# EAGLE design a-star-is31 (EAGLE 7.4.0)
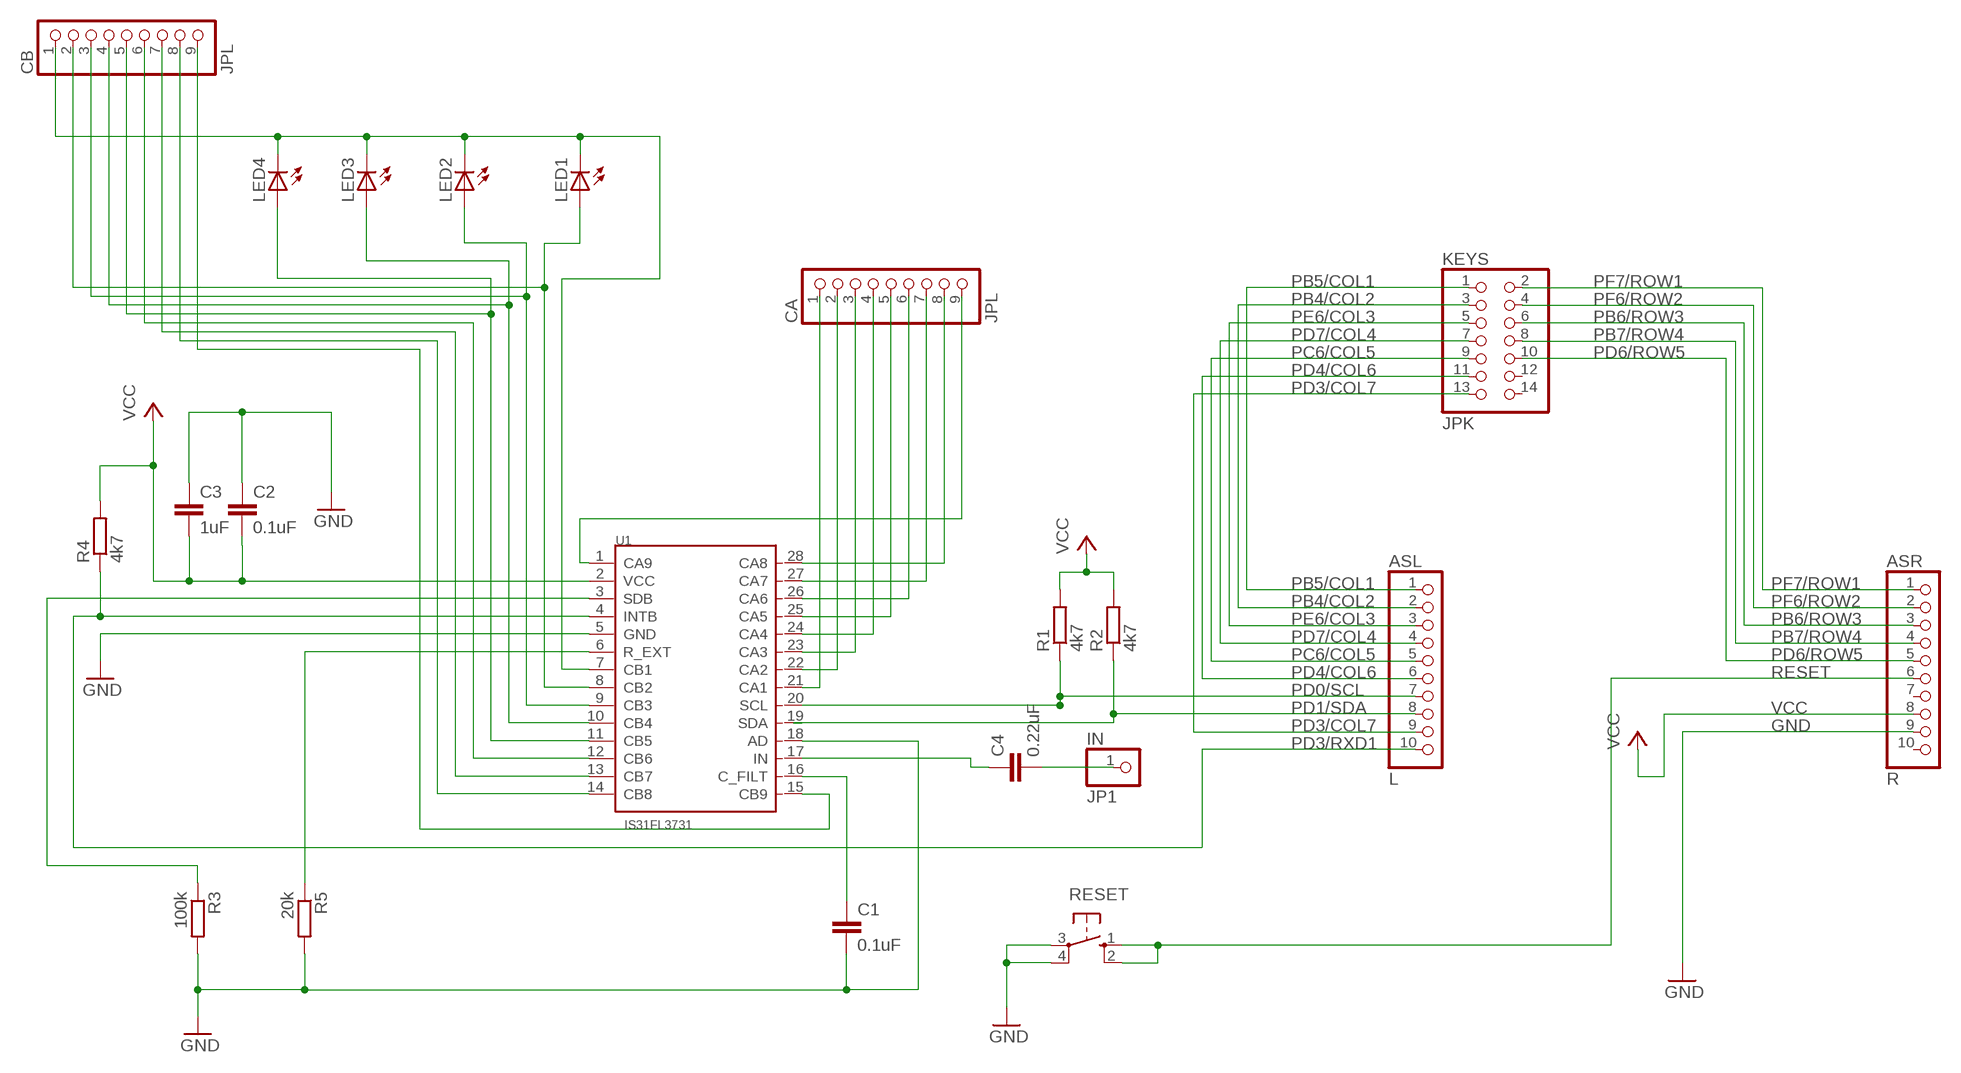
[diagram p0: schematic, sheet 1]

## Parts
ASL  L  PINHD-1X10  [1X10]
ASR  R  PINHD-1X10  [1X10]
C1  0.1uF  C-EU025-025X050  [C025-025X050]
C2  0.1uF  C-EU025-025X050  [C025-025X050]
C3  1uF  C-EU025-025X050  [C025-025X050]
C4  0.22uF  C-EU025-025X050  [C025-025X050]
CA  JPL  PINHD-1X9  [1X09]
CB  JPL  PINHD-1X9  [1X09]
IN  JP1  PINHD-1X1  [1X01]
KEYS  JPK  PINHD-2X7  [2X07]
LED1  LED3MM  [LED3MM]
LED2  LED3MM  [LED3MM]
LED3  LED3MM  [LED3MM]
LED4  LED3MM  [LED3MM]
R1  4k7  R-EU_0207/10  [0207/10]
R2  4k7  R-EU_0207/10  [0207/10]
R3  100k  R-EU_0207/10  [0207/10]
R4  4k7  R-EU_0207/10  [0207/10]
R5  20k  R-EU_0207/10  [0207/10]
RESET  10-XX  [B3F-10XX]
U1  IS31FL3731  IS31FL3731(SSOP28)  [SSOP28-0.65-10.2X5.2MM]

## Nets
CA8 [led]: CA.8 U1.28(CA8)
CB9 [led]: CB.9 U1.15(CB9)
GND: ASR.9 C1.2 C2.1 C3.1 R3.2 R5.2 RESET.3(P) RESET.4(P1) U1.5(GND) U1.18(AD)
N$1: C4.1 U1.17(IN)
N$2: C4.2 IN.1
N$5: R5.1 U1.6(R_EXT)
N$6 [led]: CA.1 U1.21(CA1)
N$7: C1.1 U1.16(C_FILT)
N$8 [led]: CA.2 U1.22(CA2)
N$9 [led]: CA.3 U1.23(CA3)
N$10 [led]: CA.4 U1.24(CA4)
N$11 [led]: CA.5 U1.25(CA5)
N$12 [led]: CA.6 U1.26(CA6)
N$13 [led]: CA.7 U1.27(CA7)
N$14 [led]: CA.9 U1.1(CA9)
N$15 [led]: CB.1 LED1.K(C) LED2.K(C) LED3.K(C) LED4.K(C) U1.7(CB1)
N$16 [led]: CB.2 LED1.A U1.8(CB2)
N$17 [led]: CB.3 LED2.A U1.9(CB3)
N$18 [led]: CB.4 LED3.A U1.10(CB4)
N$19 [led]: CB.5 LED4.A U1.11(CB5)
N$20 [led]: CB.6 U1.12(CB6)
N$22 [led]: CB.7 U1.13(CB7)
N$23 [led]: CB.8 U1.14(CB8)
PB4/COL2: ASL.2 KEYS.3
PB5/COL1: ASL.1 KEYS.1
PB6/ROW3: ASR.3 KEYS.6
PB7/ROW4: ASR.4 KEYS.8
PC6/COL5: ASL.5 KEYS.9
PD0/SCL: ASL.7 R1.1 U1.20(SCL)
PD1/SDA: ASL.8 R2.1 U1.19(SDA)
PD2/RXD1: R3.1 U1.3(SDB)
PD3/COL7: ASL.9 KEYS.13
PD3/RXD1: ASL.10 R4.1 U1.4(INTB)
PD4/COL6: ASL.6 KEYS.11
PD6/ROW5: ASR.5 KEYS.10
PD7/COL4: ASL.4 KEYS.7
PE6/COL3: ASL.3 KEYS.5
PF6/ROW2: ASR.2 KEYS.4
PF7/ROW1: ASR.1 KEYS.2
RESET: ASR.6 RESET.1(S) RESET.2(S1)
VCC [power]: ASR.8 C2.2 C3.2 R1.2 R2.2 R4.2 U1.2(VCC)
Unconnected: ASR.7 ASR.10 KEYS.12 KEYS.14

## Library data of the parts
ASL ASR = pinhead:PINHD-1X10: PIN HEADER
C1-C4 = rcl:C-EU: CAPACITOR, European symbol
CA CB = pinhead:PINHD-1X9: PIN HEADER
IN = pinhead:PINHD-1X1: PIN HEADER
KEYS = pinhead:PINHD-2X7: PIN HEADER
LED1-LED4 = led:LED: LED OSRAM: - CHIPLED LG R971, LG N971, LY N971, LG Q971, LY Q971, LO R971, LY R971 LH N974, LH R974 LS Q976, LO Q976, LY Q976 LO Q996 - Hyper CHIPLED LW Q18S LB Q993, LB Q99A, LB R99A - SideLED LS A670, LO A670, LY A670, LG A670, LP A670 LB A673, LV A673, LT A673, LW A673 LH A674 LY A675 LS A676, LA A676, LO A676, LY A676, LW A676 LS A679, LY A679, LG A679 - Hyper Micro SIDELED® LS Y876, LA Y876, LO Y876, LY Y876 LT Y87S - SmartLED LW L88C, LW L88S LB L89C, LB L89S, LG L890 LS L89K, LO L89K, LY L89K LS L896, LA L896, LO L896, LY L896 - TOPLED LS T670, LO T670, LY T670, LG T670, LP T670 LSG T670, LSP T670, LSY T670, LOP T670, LYG T670 LG T671, LOG T671, LSG T671 LB T673, LV T673, LT T673, LW T673 LH T674 LS T676, LA T676, LO T676, LY T676, LB T676, LH T676, LSB T676, LW T676 LB T67C, LV T67C, LT T67C, LS T67K, LO T67K, LY T67K, LW E67C LS E67B, LA E67B, LO E67B, LY E67B, LB E67C, LV E67C, LT E67C LW T67C LS T679, LY T679, LG T679 LS T770, LO T770, LY T770, LG T770, LP T770 LB T773, LV T773, LT T773, LW T773 LH T774 LS E675, LA E675, LY E675, LS T675 LS T776, LA T776, LO T776, LY T776, LB T776 LHGB T686 LT T68C, LB T68C - Hyper Mini TOPLED® LB M676 - Mini TOPLED Santana® LG M470 LS M47K, LO M47K, LY M47K Source: http://www.osram.convergy.de LUXEON: - LUMILED® LXK2-PW12-R00, LXK2-PW12-S00, LXK2-PW14-U00, LXK2-PW14-V00 LXK2-PM12-R00, LXK2-PM12-S00, LXK2-PM14-U00 LXK2-PE12-Q00, LXK2-PE12-R00, LXK2-PE12-S00, LXK2-PE14-T00, LXK2-PE14-U00 LXK2-PB12-K00, LXK2-PB12-L00, LXK2-PB12-M00, LXK2-PB14-N00, LXK2-PB14-P00, LXK2-PB14-Q00 LXK2-PR12-L00, LXK2-PR12-M00, LXK2-PR14-Q00, LXK2-PR14-R00 LXK2-PD12-Q00, LXK2-PD12-R00, LXK2-PD12-S00 LXK2-PH12-R00, LXK2-PH12-S00 LXK2-PL12-P00, LXK2-PL12-Q00, LXK2-PL12-R00 Source: www.luxeon.com KINGBRIGHT: KA-3528ASYC Source: www.kingbright.com
R1-R5 = rcl:R-EU_: RESISTOR, European symbol
RESET = switch-omron:10-XX: OMRON SWITCH; MPN: B3F-1000; OC_FARNELL: 176432; OC_NEWARK: 36M3542
U1 = kiibohd:IS31FL3731(SSOP28): 310080003; MPN: WM8731SEDS/V

## Net classes
0 default: width 0.305 mm
1 power: width 0.406 mm
2 led: width 0.406 mm

## Board
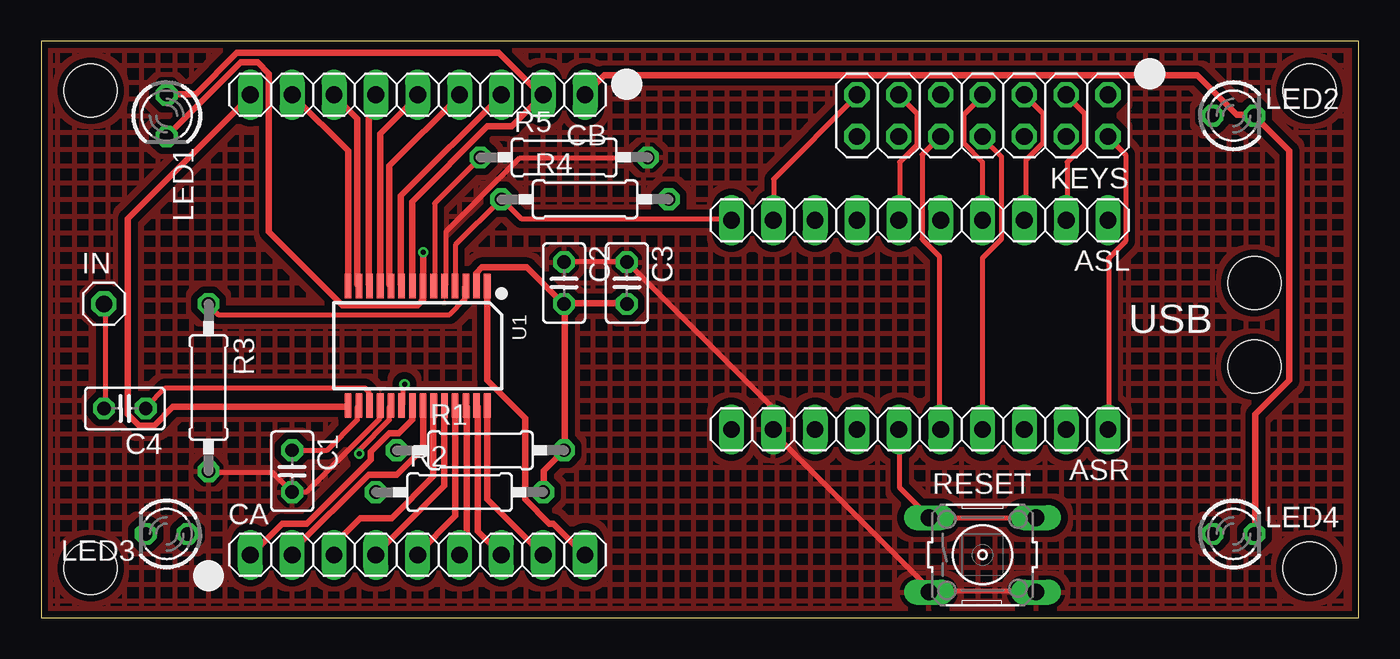
[diagram p1: board, top side]
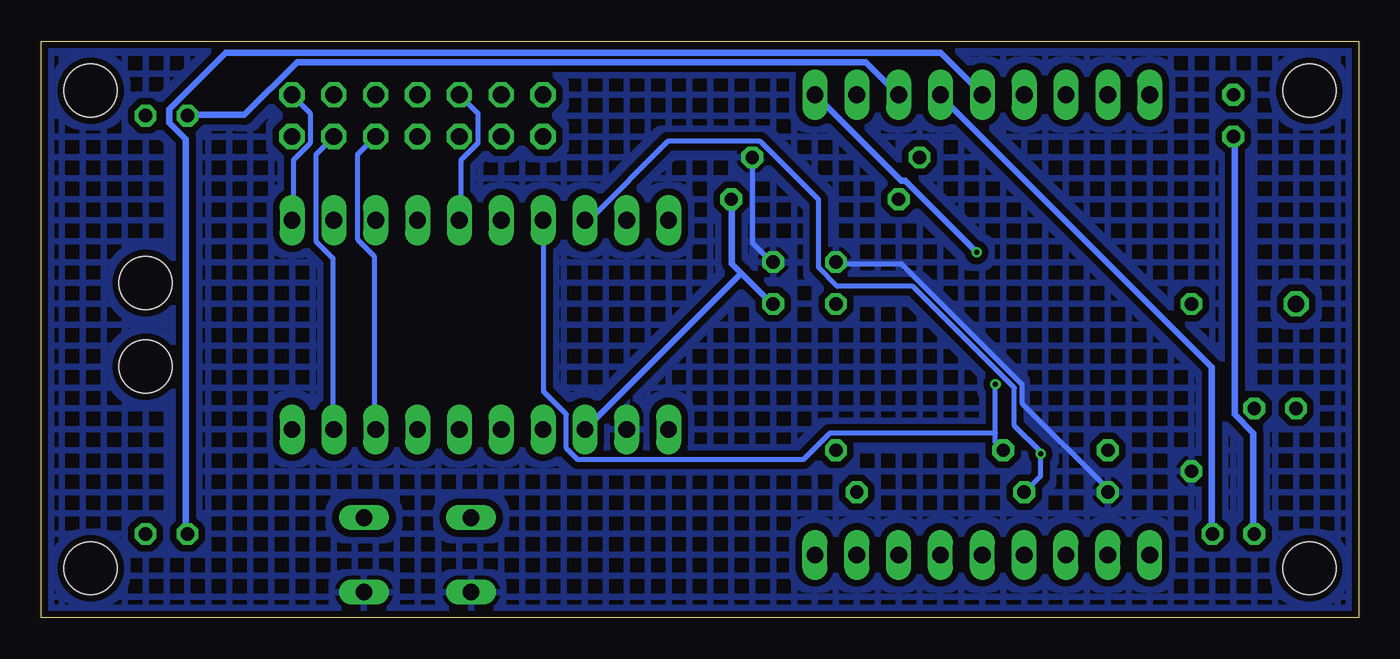
[diagram p2: board, bottom side, seen from below]

Size 80 x 35 mm. Coordinates in mm from the lower left corner, seen from the top.
Outline: 0,0 80,0 80,35 0,35 0,0
Copper layers (1*16): Top 0.035mm / dielectric 1.5mm / Bottom 0.035mm
Design rules "Elecrow_2-layer_eagle_rule": minimum track width 6mil, minimum drill 12mil, track to track 6mil, track to pad 6mil, pad to pad 6mil, via to via 6mil, smd to smd 0mil, copper to edge 10mil, drill to drill 10mil, minimum pad ring 10mil, minimum via ring 6mil, stop-mask expansion 2mil, vias tented up to drill 100mil, thermal gap 10mil
Holes 3.2 mm at 3,32 3,3 77,32 77,3 73.66,20.32 73.66,15.24

### Footprints (pad centres in the part's own frame; a part is rotated, then mirrored left to right if it is on the bottom)
1X10 = drill 1.016 long: 1 -11.43,0; 2 -8.89,0; 3 -6.35,0; 4 -3.81,0; 5 -1.27,0; 6 1.27,0; 7 3.81,0; 8 6.35,0; 9 8.89,0; 10 11.43,0
C025-025X050 = drill 0.813 octagon: 1 -1.27,0; 2 1.27,0
1X09 = drill 1.016 long: 1 -10.16,0; 2 -7.62,0; 3 -5.08,0; 4 -2.54,0; 5 0,0; 6 2.54,0; 7 5.08,0; 8 7.62,0; 9 10.16,0
1X01 = drill 1.016 octagon: 1 0,0
2X07 = drill 1.016 octagon: 1 -7.62,-1.27; 2 -7.62,1.27; 3 -5.08,-1.27; 4 -5.08,1.27; 5 -2.54,-1.27; 6 -2.54,1.27; 7 0,-1.27; 8 0,1.27; 9 2.54,-1.27; 10 2.54,1.27; 11 5.08,-1.27; 12 5.08,1.27; 13 7.62,-1.27; 14 7.62,1.27
LED3MM = drill 0.813 octagon: A -1.27,0; K 1.27,0
0207/10 = drill 0.813 octagon: 1 -5.08,0; 2 5.08,0
B3F-10XX = drill 1.016 long: 1 -3.251,2.261; 2 3.251,2.261; 3 -3.251,-2.261; 4 3.251,-2.261
SSOP28-0.65-10.2X5.2MM = smd 0.4 x 1.5: 1 -4.225,-3.625; 2 -3.575,-3.625; 3 -2.925,-3.625; 4 -2.275,-3.625; 5 -1.625,-3.625; 6 -0.975,-3.625; 7 -0.325,-3.625; 8 0.325,-3.625; 9 0.975,-3.625; 10 1.625,-3.625; 11 2.275,-3.625; 12 2.925,-3.625; 13 3.575,-3.625; 14 4.225,-3.625; 15 4.225,3.625; 16 3.575,3.625; 17 2.925,3.625; 18 2.275,3.625; 19 1.625,3.625; 20 0.975,3.625; 21 0.325,3.625; 22 -0.325,3.625; 23 -0.975,3.625; 24 -1.625,3.625; 25 -2.275,3.625; 26 -2.925,3.625; 27 -3.575,3.625; 28 -4.225,3.625

### Placement (x,y rotation side)
ASL  53.34,24.13 180 top
ASR  53.34,11.43 180 top
C1  15.24,8.89 270 top
C2  31.75,20.32 270 top
C3  35.56,20.32 270 top
C4  5.08,12.7 180 top
CA  22.86,3.81 0 top
CB  22.86,31.75 180 top
IN  3.81,19.05 0 top
KEYS  57.15,30.48 180 top
LED1  7.62,30.48 270 top
LED2  72.39,30.48 0 top
LED3  7.62,5.08 180 top
LED4  72.39,5.08 0 top
R1  26.67,10.16 0 top
R2  25.4,7.62 0 top
R3  10.16,13.97 270 top
R4  33.02,25.4 0 top
R5  31.75,27.94 0 top
RESET  57.15,3.81 0 top
U1  22.86,16.51 180 top

### Tracks (layer width: path | path; a pad name or v marks a point on that pad's centre or on a via)
CA8
  Top 0.406: U1.28 27.09,12.8 27.09,7.2 30.4,3.89 CA.8
CB9
  Top 0.406: U1.15 18.63,12.8 8,12.8 6.86,11.66 5.94,11.66 5.26,12.34 5.26,24.23 12.69,31.66 CB.9
GND
  Top 0.305: U1.5 24.57,20.23 24.57,23.43 29.03,27.89 36.8,27.89 R5.2 | U1.18 20.57,12.8 20.57,12.12 16.12,7.66 15.32,7.66 C1.2 15.2,7.66 14.06,8.8 10.17,8.8 R3.2 | RESET.4 60.35,1.6 53.95,1.6 RESET.3 53.95,1.71 44.35,11.32 ASR.9 44.35,11.43 44.35,12.8 35.66,21.49 C3.1 35.55,21.6 31.77,21.6 C2.1
  Bottom 0.305: C1.2 15.32,7.66 15.32,7.89 20.46,13.03 20.46,14.17 27.77,21.49 31.66,21.49 C2.1 | R5.2 36.8,27.89 36.8,22.75 35.66,21.6 C3.1
  pour Bottom (isolate 0.406, hatched): 0,0 0,35.56 80.01,35.56 80.01,0
  pour Top (isolate 0.406, hatched): 0,0 0,35.56 80.01,35.56 80.01,0
N$1
  Top 0.305: U1.17 19.89,12.92 19.89,13.72 19.66,13.95 7.54,13.95 6.4,12.8 C4.1
N$2
  Top 0.305: C4.2 3.89,12.8 3.89,18.97 IN.1
N$5
  Top 0.305: U1.6 23.89,20.23 23.89,25.15 26.63,27.89 R5.1
N$6
  Top 0.406: U1.21 22.52,12.8 22.52,12 21.72,11.2 21.14,11.2 20,10.06 20,9.6 16.12,5.71 14.63,5.71 12.8,3.89 CA.1
N$7
  Top 0.305: U1.16 19.2,12.8 19.2,12 17.37,10.17 15.32,10.17 C1.1
N$8
  Top 0.406: U1.22 23.2,12.8 23.2,10.29 21.6,8.69 19.89,8.69 15.32,4.12 15.32,3.89 CA.2
N$9
  Top 0.406: U1.23 23.81,12.88 23.81,8.57 21.27,6.03 19.68,6.03 19.37,6.03 17.78,4.45 CA.3
N$10
  Top 0.406: U1.24 24.46,12.8 24.46,8 20.34,3.89 CA.4
N$11
  Top 0.406: U1.25 25.15,12.8 25.15,6.17 22.86,3.89 CA.5
N$12
  Top 0.406: U1.26 25.83,12.8 25.83,4.23 25.49,3.89 CA.6
N$13
  Top 0.406: U1.27 26.52,12.8 26.52,5.26 27.89,3.89 CA.7
N$14
  Top 0.406: U1.1 27.09,20.12 27.09,14.4 29.38,12.12 29.38,7.2 30.86,5.71 31.09,5.71 32.92,3.89 CA.9
N$15  (via drill 0.3)
  Top 0.406: LED4.K 73.72,5.14 73.72,12.34 75.78,14.4 75.78,28.35 73.72,30.4 LED2.K 73.5,30.52 72.58,30.52 70.18,32.92 34.18,32.92 33.03,31.77 CB.1 | LED1.K 7.66,29.26 12.12,33.72 13.14,33.72 13.83,33.03 13.83,23.43 18.29,18.97 22.86,18.97 23.2,19.32 23.2,20.12 U1.7 23.2,20.23 v23.2,22.17
  Bottom 0.406: LED3.K 6.4,5.14 6.4,11.2 7.54,12.34 7.54,29.15 LED1.K | v23.2,22.17 27.55,26.52 27.77,26.52 32.92,31.66 CB.1
N$16
  Top 0.406: U1.8 22.52,20.23 22.52,25.26 27.09,29.83 28.57,29.83 30.4,31.66 CB.2 30.29,31.77 27.77,34.29 11.89,34.29 9.37,31.77 7.66,31.77 LED1.A
N$17
  Top 0.406: U1.9 21.83,20.23 21.83,25.6 27.89,31.66 CB.3
  Bottom 0.406: LED2.A 71.09,30.52 67.67,30.52 64.47,33.72 29.95,33.72 28,31.77 CB.3
N$18
  Top 0.406: U1.10 21.14,20.23 21.14,27.43 25.38,31.66 CB.4
  Bottom 0.406: LED3.A 8.91,5.14 8.91,15.2 25.38,31.66 CB.4
N$19
  Top 0.406: U1.11 20.57,20.23 20.57,29.38 22.86,31.66 CB.5
  Bottom 0.406: LED4.A 71.21,5.14 71.21,29.03 72.24,30.06 72.24,30.86 68.81,34.29 25.38,34.29 22.86,31.77 CB.5
N$20
  Top 0.406: U1.12 19.89,20.23 19.89,31.32 20.23,31.66 CB.6
N$22
  Top 0.406: U1.13 19.2,20.23 19.2,30.29 17.83,31.66 CB.7
N$23
  Top 0.406: U1.14 18.63,20.23 18.63,28.35 15.32,31.66 CB.8
PB4/COL2
  Top 0.305: ASL.2 62.29,24.23 62.29,27.66 63.32,28.69 63.32,30.63 62.29,31.66 KEYS.3
PB5/COL1
  Bottom 0.305: ASL.1 64.69,24.23 64.69,27.77 63.66,28.8 63.66,30.63 64.69,31.66 KEYS.1
PB6/ROW3
  Bottom 0.305: ASR.3 59.78,11.43 59.78,21.95 60.81,22.97 60.81,28.12 59.78,29.15 KEYS.6
PB7/ROW4
  Top 0.305: ASR.4 57.15,21.83 58.29,22.97 58.29,28 57.15,29.15 KEYS.8
PC6/COL5
  Bottom 0.305: ASL.5 54.52,24.23 54.52,27.77 53.49,28.8 53.49,30.63 54.52,31.66 KEYS.9
PD0/SCL  (via drill 0.3)
  Top 0.305: v22.06,14.17 21.95,14.06 21.95,12.92 U1.20
  Bottom 0.305: 22.06,11.2 22.06,10.63 21.6,10.17 R1.1 | 22.06,11.2 v22.06,14.17 | ASL.7 49.49,24.12 49.49,13.72 48.12,12.34 48.12,10.29 47.43,9.6 33.72,9.6 32.12,11.2 22.17,11.2 22.06,11.2
PD1/SDA  (via drill 0.3)
  Top 0.305: v19.32,9.94 19.32,10.17 21.14,12 21.14,12.8 U1.19
  Bottom 0.305: R2.1 20.23,7.66 19.32,8.57 v19.32,9.94 19.32,10.06 20.92,11.66 20.92,13.95 27.09,20.12 31.66,20.12 32.8,21.26 32.8,25.38 36.35,28.92 41.95,28.92 46.63,24.23 46.98,24.23 ASL.8
PD2/RXD1
  Top 0.305: U1.3 25.72,20.12 25.72,19.32 24.8,18.4 10.74,18.4 10.17,18.97 R3.1
PD3/COL7
  Top 0.305: ASL.9 44.46,24.23 44.46,26.63 49.49,31.66 KEYS.13
PD3/RXD1
  Top 0.305: U1.4 25.15,20.23 25.15,22.63 27.89,25.38 R4.1 28,25.38 29.15,24.23 41.83,24.23 ASL.10
PD4/COL6
  Top 0.305: ASL.6 52.12,24.23 52.12,27.66 53.15,28.69 53.15,30.63 52.12,31.66 KEYS.11
PD6/ROW5
  Top 0.305: ASR.5 54.52,11.43 54.52,21.95 53.49,22.97 53.49,28.12 54.52,29.15 KEYS.10
PD7/COL4
  Top 0.305: ASL.4 57.15,24.23 57.15,27.66 56.01,28.8 56.01,30.52 57.15,31.66 KEYS.7
PE6/COL3
  Top 0.305: ASL.3 59.78,24.23 59.78,27.77 60.81,28.8 60.81,30.63 59.78,31.66 KEYS.5
PF6/ROW2
  Bottom 0.305: ASR.2 62.29,11.43 62.29,21.83 63.32,22.86 63.32,28.12 62.29,29.15 KEYS.4
PF7/ROW1
  Top 0.305: ASR.1 64.81,11.43 64.81,21.83 65.84,22.86 65.84,28.12 64.81,29.15 KEYS.2
RESET
  Top 0.305: ASR.6 52.12,11.43 52.12,7.89 53.84,6.17 RESET.1 53.95,6.06 60.35,6.06 RESET.2
VCC
  Top 0.406: R2.2 30.52,7.66 30.52,8.91 31.66,10.06 R1.2 31.77,10.29 31.77,18.86 C2.2 | U1.2 26.4,20.23 26.4,20.92 26.75,21.26 29.49,21.26 31.66,19.09 C2.2 | C3.2 35.55,19.09 31.89,19.09 C2.2
  Bottom 0.406: 37.49,20.92 35.66,19.09 C3.2 | 37.49,20.92 38.06,21.49 38.06,25.38 R4.2 | ASR.8 46.98,11.43 37.6,20.8 37.49,20.92

### Text on the board
tNames: USB